# EAGLE design arduino_power_supply (EAGLE 6.6.0)
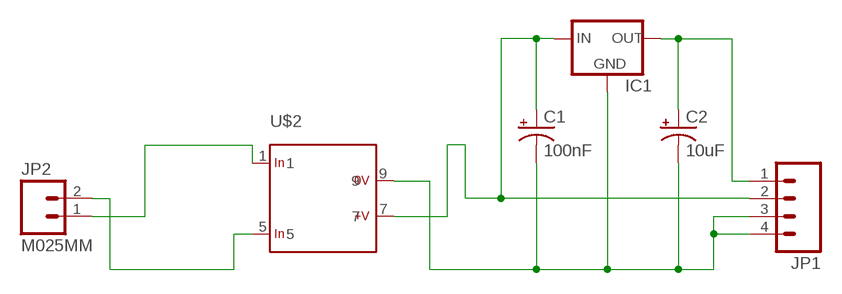
[diagram p0: schematic, sheet 1]

## Parts
C1  100nF  CAP_POLPTH2  [CPOL-RADIAL-10UF-25V]
C2  10uF  CAP_POLPTH2  [CPOL-RADIAL-10UF-25V]
IC1  78XXS  [78XXS]
JP1  M04PTH  [1X04]
JP2  M025MM  [SCREWTERMINAL-5MM-2]
U$2  SINGLE  [1]

## Nets
N$1: C1.2(-) C2.2(-) IC1.GND JP1.3 JP1.4 U$2.9
N$2: C1.1(+) IC1.IN JP1.2 U$2.7
N$3: C2.1(+) IC1.OUT JP1.1
N$4: JP2.1 U$2.1
N$5: JP2.2 U$2.5

## Library data of the parts
C1 C2 = SparkFun-Passives:CAP_POL: Capacitor Polarized These are standard SMD and PTH capacitors. Normally 10uF, 47uF, and 100uF in electrolytic and tantalum varieties. Always verify the external diameter of the through hole cap, it varies with capacity, voltage, and manufacturer. The EIA devices should be standard.
IC1 = v-reg:78XXS: VOLTAGE REGULATOR
JP1 = SparkFun-Connectors:M04: Header 4 Standard 4-pin 0.1" header. Use with straight break away headers (SKU : PRT-00116), right angle break away headers (PRT-00553), swiss pins (PRT-00743), machine pins (PRT-00117), and female headers (PRT-00115). Molex polarized connector foot print use with SKU : PRT-08231 with associated crimp pins and housings. 1MM SMD Version SKU: PRT-10208
JP2 = SparkFun-Connectors:M02: Standard 2-pin 0.1" header. Use with - straight break away headers ( PRT-00116) - right angle break away headers (PRT-00553) - swiss pins (PRT-00743) - machine pins (PRT-00117) - female headers (PRT-00115) Molex polarized connector foot print use with: PRT-08233 with associated crimp pins and housings. 2.54_SCREWTERM for use with PRT-10571. 3.5mm Screw Terminal footprints for PRT-08084 5mm Screw Terminal footprints for use with PRT-08433
U$2 = myrra:SINGLE: One Output Input voltage range: 85 to 265 V AC or 85 to 370 V DC Input frequency: 47 to 440 Hz Output voltage accuracy (full load ): ± 2% Line output voltage variation: ± 0.3% Load output voltage variation: ± 0.5% Temperature range: -25 - TA (°C) No load input power: < 200mW regulated: Reference Output Current Power Efficiency Ta Volts mA Watts % °C 47121 3.3 750 2.5 65 +70 47122 5 550 2.75 68 +70 47123 9 270 2.5 72 +70 47124 12 210 2.5 74 +70 47125 15 170 2.5 75 +70 47126 24 110 2.5 77 +70 47151 3.3 1350 4.2 65 +50 47152 5 900 4.5 68 +50 47153 9 550 5 72 +50 47154 12 420 5 75 +50 47155 15 320 5 76 +50 47156 24 220 5 79 +50 non regulated: Reference Output Current Power Efficiency Ta Volts mA Watts % °C 47114 12 200 2.4 74 +70 47133 9 360 3.2 73 +70 47134 12 270 3.2 75 +70 47136 24 130 3.2 80 +70 47163 9 560 5* 73 +50 47164 12 420 5* 75 +50 47166 24 210 5* 80 +50 * Nota: Power up to 5.4W is possible with input voltage > 97 V AC Source: http://www.myrra.com

## Board
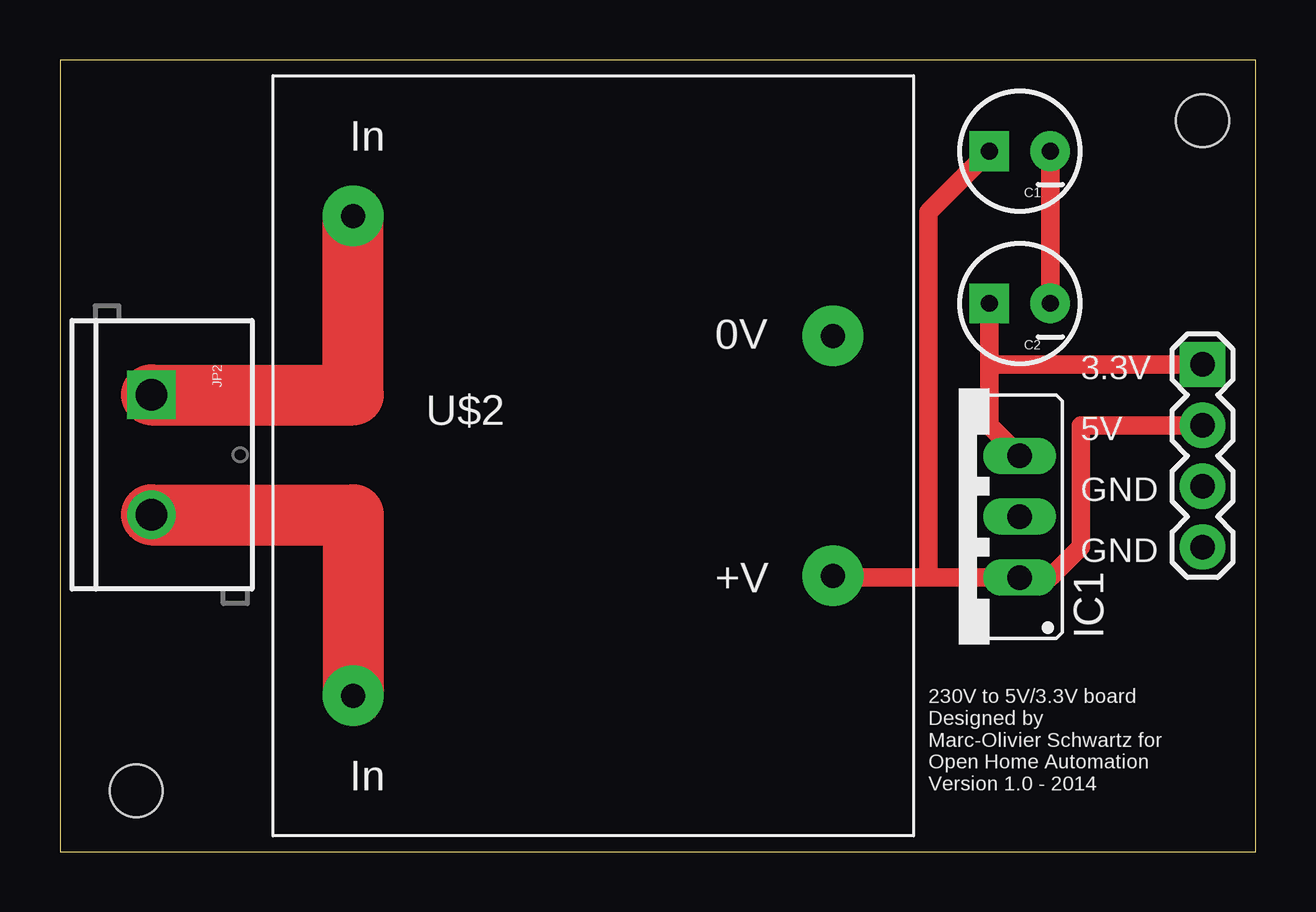
[diagram p1: board, top side]
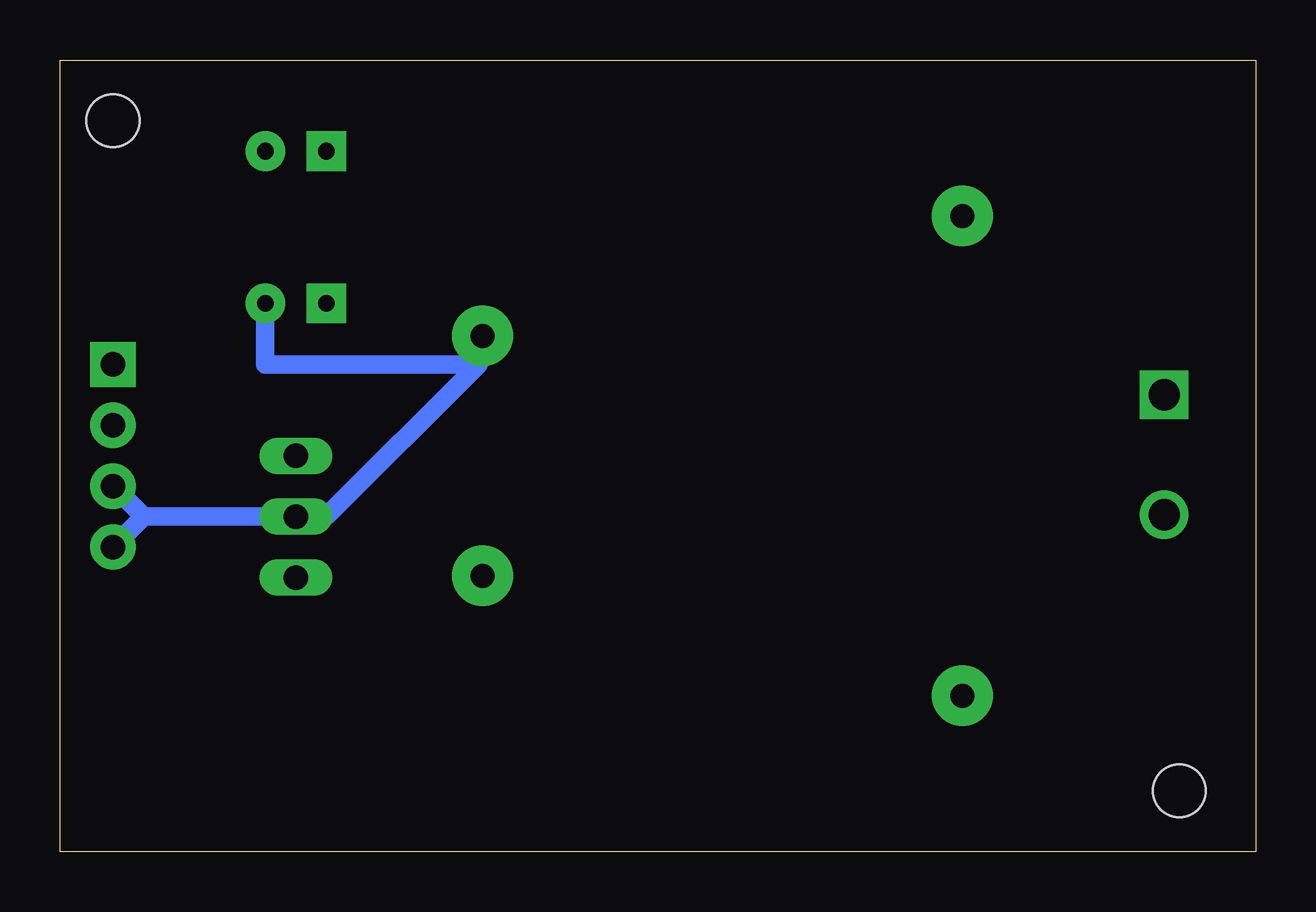
[diagram p2: board, bottom side, seen from below]

Size 49.84 x 33.01 mm. Coordinates in mm from the lower left corner, seen from the top.
Outline: 0,0 49.84,0 49.84,33.01 0,33.01 0,0
Copper layers (1*16): Top 0.035mm / dielectric 1.5mm / Bottom 0.035mm
Design rules "default *": minimum track width 30mil, minimum drill 24mil, track to track 20mil, track to pad 20mil, pad to pad 20mil, via to via 20mil, smd to smd 8mil, copper to edge 40mil, drill to drill 8mil, minimum pad ring 10mil, minimum via ring 8mil, stop-mask expansion 4mil, vias tented up to drill 0mil, thermal gap 10mil
Holes 2.2 mm at 3.17,2.54 47.62,30.48

### Footprints (pad centres in the part's own frame; a part is rotated, then mirrored left to right if it is on the bottom)
CPOL-RADIAL-10UF-25V = drill 0.7 pad 1.651 square: 1 1.27,0 | drill 0.7 pad 1.651: 2 -1.27,0
78XXS = drill 1.016 long: GND 0,-2.54; IN -2.54,-2.54; OUT 2.54,-2.54
1X04 = drill 1.016 pad 1.88 square: 1 0,0 | drill 1.016 pad 1.88: 2 2.54,0; 3 5.08,0; 4 7.62,0
SCREWTERMINAL-5MM-2 = drill 1.3 pad 2.032 square: 1 0,0 | drill 1.3 pad 2.032: 2 5,0
1 = drill 1 pad 2.54: 1 -10,10; 5 -10,-10; 7 10,-5; 9 10,5

### Placement (x,y rotation side)
C1  40,29.21 180 top
C2  40,22.86 180 top
IC1  37.46,13.97 90 top
JP1  47.62,20.32 270 top
JP2  3.81,19.05 270 top
U$2  22.23,16.51 0 top

### Tracks (layer width: path | path; a pad name or v marks a point on that pad's centre or on a via)
N$1
  Top 0.762: C1.2 C2.2
  Bottom 0.762: 46.35,13.97 IC1.GND 38.73,13.97 32.38,20.32 | JP1.3 46.35,13.97 | 46.35,13.97 JP1.4 | C2.2 41.27,20.32 32.38,20.32 | 32.38,20.32 U$2.9
N$2
  Top 0.762: 36.2,11.43 32.38,11.43 U$2.7 | 36.2,11.43 IC1.IN 41.27,11.43 42.54,12.7 42.54,17.78 JP1.2 | C1.1 36.2,26.67 36.2,11.43
N$3
  Top 0.762: IC1.OUT 38.73,17.78 38.73,20.32 | C2.1 38.73,20.32 | 38.73,20.32 JP1.1
N$4
  Top 2.54: JP2.1 12.22,19.05 U$2.1
N$5
  Top 2.54: JP2.2 12.22,14.05 U$2.5

### Text on the board
tNames: 3.3V | 5V | GND | GND | 230V to 5V/3.3V board / Designed by / Marc-Olivier Schwartz for / Open Home Automation / Version 1.0 - 2014